# Altium schematic sheet GPIO-Debug.SchDoc: =ProjectDescription
size 297 x 209 mm; Address1: Address1; Address2: Address2; Address3: Address3; Address4: Address4; SheetNumber: 5; SheetTotal: 8; Scale: 1:1; DocumentType: Схема электрическая принципиальная
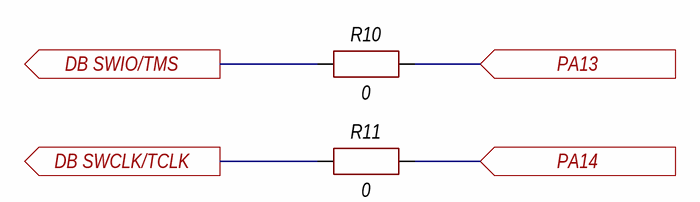
[diagram p0: GPIO-Debug.SchDoc]

## Parts
R10  0  [CH0402R]
R11  0  [CH0402R]

## Ports
DB SWCLK/TCLK (out), DB SWIO/TMS (out), PA13 (in), PA14 (in)

## Nets
DB SWCLK/TCLK: R11.1 ; port DB SWCLK/TCLK
DB SWIO/TMS: R10.1 ; port DB SWIO/TMS
PA13: R10.2 ; port PA13
PA14: R11.2 ; port PA14

## Notes on the sheet
- Изм.
- Лист
- № докум.
- Подп.
- Дата
- Копировал
- Формат А4

## Library data of the parts
R10 R11 = Resistor: Manufacturer: *; Model: *; HelpURL: *; ComponentKind: *; Value: 0